# Altium project POTENCIOSTATO_REV12.PrjPcb (part 2 of 2)
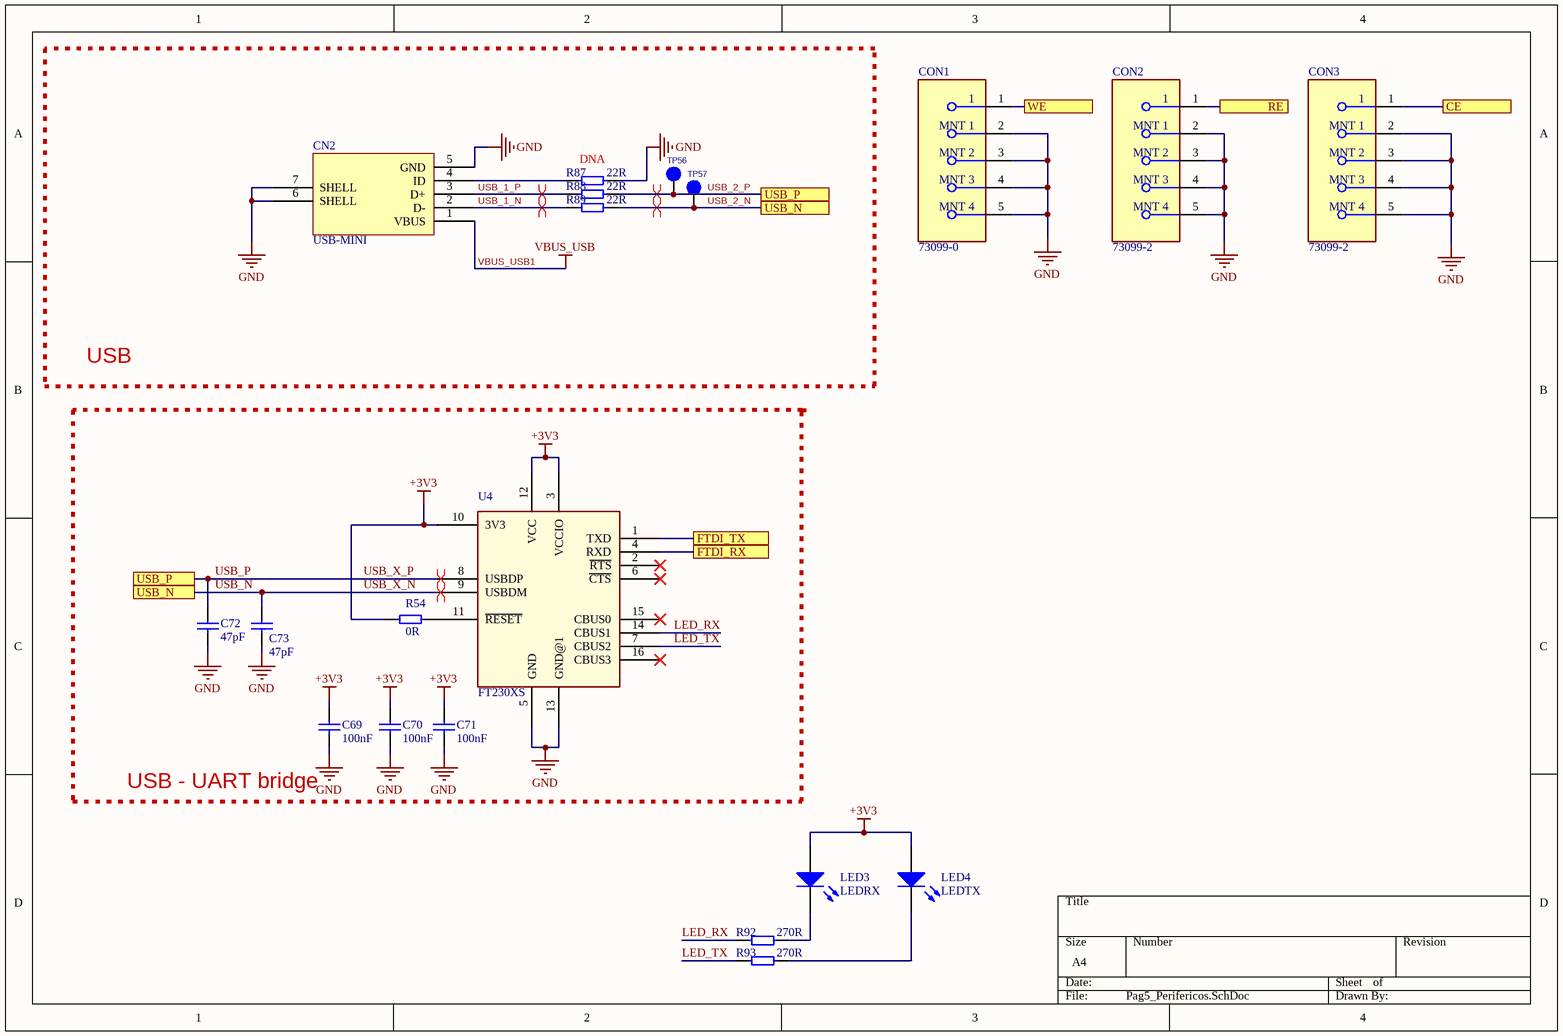
[diagram p5: Pag5_Perifericos.SchDoc]

## Nets that join several sheets
+3V3: Pag1_PowerSupply (C1.2 C14.1 L1.1 R13.2), Pag2_Battery_Charger (R21.2 R23.2 R32.1 R34.1), Pag3_Front_end_adc_dac (9 pins), Pag4_Processador (6 pins), Pag5_Perifericos (9 pins)
+5VCC: Pag1_PowerSupply (C7.1 L2.2 TP2.1), Pag3_Front_end_adc_dac (7 pins)
EXT_GND_DETECT: Pag1_PowerSupply (19 pins), Pag2_Battery_Charger (15 pins), Pag3_Front_end_adc_dac (55 pins), Pag4_Processador (21 pins), Pag5_Perifericos (23 pins)
V_BUS: Pag1_PowerSupply (6 pins), Pag2_Battery_Charger (12 pins)
VBUS_USB1: Pag2_Battery_Charger (5 pins), Pag5_Perifericos (CN2.1)
I2C_SCL: Pag2_Battery_Charger (R21.1 U2.5 U3.C1), Pag3_Front_end_adc_dac (R62.2), Pag4_Processador (IC8.36 TP51.1)
I2C_SDA: Pag2_Battery_Charger (R23.1 U2.6 U3.B1), Pag3_Front_end_adc_dac (R64.2), Pag4_Processador (IC8.33 TP45.1)
NetCN3_1: Pag3_Front_end_adc_dac (CN3.1 IC6.3 R65.1), Pag5_Perifericos (CON2.1)
NetCN3_2: Pag3_Front_end_adc_dac (CN3.2 IC6.5 R63.1), Pag5_Perifericos (CON1.1)
NetCN3_3: Pag3_Front_end_adc_dac (CN3.3 IC5.14), Pag5_Perifericos (CON3.1)
NetD2_A: Pag1_PowerSupply (D2.A R13.1 R14.2 TP7.1), Pag4_Processador (R66.1)
NetIC3_5: Pag3_Front_end_adc_dac (IC3.5 R45.2 R49.2), Pag4_Processador (IC8.8 TP44.1)
NetIC3_6: Pag3_Front_end_adc_dac (IC3.6 IC4.22 R53.1 R71.2), Pag4_Processador (IC8.30 TP41.1)
NetIC3_7: Pag3_Front_end_adc_dac (IC3.7 R37.1 R47.2), Pag4_Processador (IC8.9 TP55.1)
NetIC3_8: Pag3_Front_end_adc_dac (IC3.8 IC4.20 R46.2 R56.1), Pag4_Processador (IC8.37 TP53.1)
NetIC4_17: Pag3_Front_end_adc_dac (IC4.17 R51.1 R70.2), Pag4_Processador (IC8.10 TP47.1)
NetIC4_18: Pag3_Front_end_adc_dac (IC4.18 R58.1), Pag4_Processador (IC8.28)
NetIC4_19: Pag3_Front_end_adc_dac (IC4.19 R57.1), Pag4_Processador (IC8.12 TP50.1)
NetIC4_21: Pag3_Front_end_adc_dac (IC4.21 R55.1 R72.2), Pag4_Processador (IC8.31 TP43.1)
NetIC4_23: Pag3_Front_end_adc_dac (IC4.23 R52.1 R73.2), Pag4_Processador (IC8.29 TP40.1)
NetIC8_11: Pag3_Front_end_adc_dac (R59.2), Pag4_Processador (IC8.11 TP46.1)
NetIC8_34: Pag4_Processador (IC8.34 TP48.1), Pag5_Perifericos (U4.1)
NetIC8_35: Pag4_Processador (IC8.35 TP49.1), Pag5_Perifericos (U4.4)
NetR16_2: Pag1_PowerSupply (R16.2 TP8.1), Pag4_Processador (R69.2)